# Altium schematic sheet 海关全向本体电路板V3_主控芯片.SchDoc
size A4
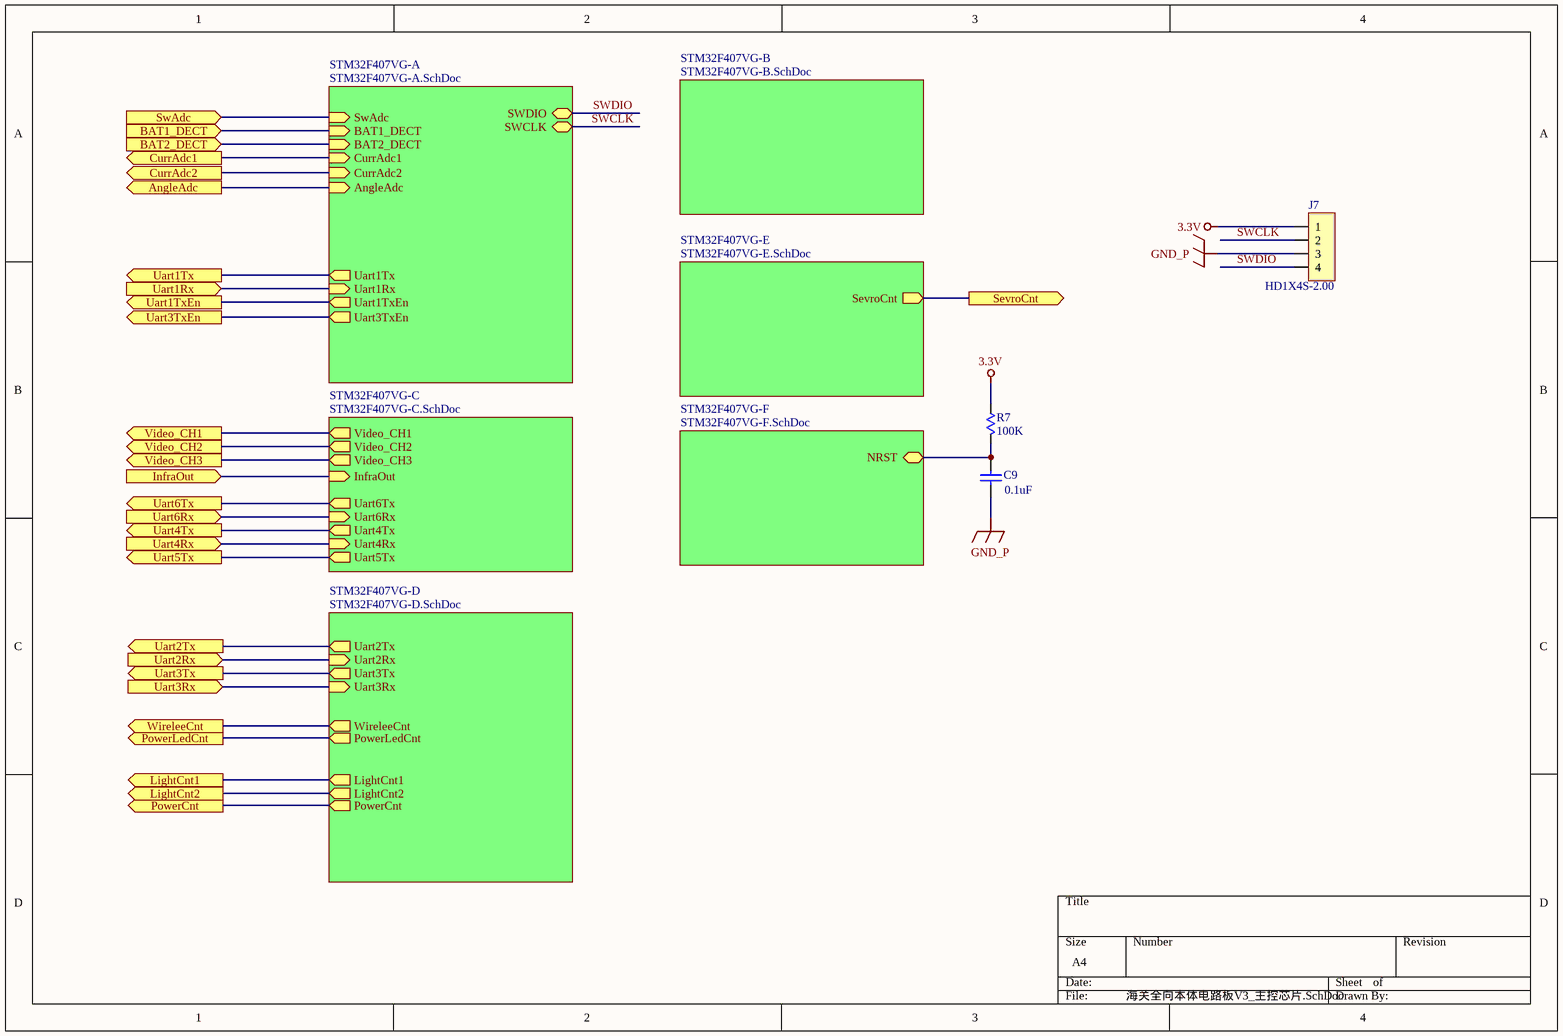
[diagram p0: 海关全向本体电路板V3_主控芯片.SchDoc]

## Parts
C9  0.1uF  [C0603-S]
J7  HD1X4S-2.00  [HD1X4S-2.00]
R7  100K  [R0603-S]

## Sub-sheets
STM32F407VG-A = STM32F407VG-A.SchDoc: SWDIO (bidir), SWCLK (bidir), Uart1Tx (out), Uart1Rx (in), AngleAdc (in), CurrAdc1 (in), BAT2_DECT (in), BAT1_DECT (in), SwAdc (in), CurrAdc2 (in), Uart1TxEn (out), Uart3TxEn (out)
STM32F407VG-B = STM32F407VG-B.SchDoc: no entries
STM32F407VG-C = STM32F407VG-C.SchDoc: Uart4Tx (out), Uart4Rx (in), Uart5Tx (out), Video_CH3 (out), Video_CH2 (out), Video_CH1 (out), Uart6Tx (out), Uart6Rx (in), InfraOut (in)
STM32F407VG-D = STM32F407VG-D.SchDoc: Uart2Tx (out), Uart2Rx (in), Uart3Tx (out), PowerLedCnt (out), LightCnt1 (out), Uart3Rx (in), PowerCnt (out), LightCnt2 (out), WireleeCnt (out)
STM32F407VG-E = STM32F407VG-E.SchDoc: SevroCnt (out)
STM32F407VG-F = STM32F407VG-F.SchDoc: NRST (bidir)

## Ports
AngleAdc (out), BAT1_DECT (in), BAT2_DECT (in), CurrAdc1 (out), CurrAdc2 (out), InfraOut (in), LightCnt1 (out), LightCnt2 (out), PowerCnt (out), PowerLedCnt (out), SevroCnt (out), SwAdc (in), Uart1Rx (in), Uart1Tx (out), Uart1TxEn (out), Uart2Rx (in), Uart2Tx (out), Uart3Rx (in), Uart3Tx (out), Uart3TxEn (out), Uart4Rx (in), Uart4Tx (out), Uart5Tx (out), Uart6Rx (in), Uart6Tx (out), Video_CH1 (out), Video_CH2 (out), Video_CH3 (out), WireleeCnt (out)

## Nets
3.3V: J7.1 R7.2
GND_P: C9.2 J7.3
AngleAdc: port AngleAdc, sheet STM32F407VG-A/AngleAdc
BAT1_DECT: port BAT1_DECT, sheet STM32F407VG-A/BAT1_DECT
BAT2_DECT: port BAT2_DECT, sheet STM32F407VG-A/BAT2_DECT
CurrAdc1: port CurrAdc1, sheet STM32F407VG-A/CurrAdc1
CurrAdc2: port CurrAdc2, sheet STM32F407VG-A/CurrAdc2
InfraOut: port InfraOut, sheet STM32F407VG-C/InfraOut
LightCnt1: port LightCnt1, sheet STM32F407VG-D/LightCnt1
LightCnt2: port LightCnt2, sheet STM32F407VG-D/LightCnt2
PowerCnt: port PowerCnt, sheet STM32F407VG-D/PowerCnt
PowerLedCnt: port PowerLedCnt, sheet STM32F407VG-D/PowerLedCnt
SevroCnt: port SevroCnt, sheet STM32F407VG-E/SevroCnt
SwAdc: port SwAdc, sheet STM32F407VG-A/SwAdc
SWCLK: J7.2 ; sheet STM32F407VG-A/SWCLK
SWDIO: J7.4 ; sheet STM32F407VG-A/SWDIO
Uart1Rx: port Uart1Rx, sheet STM32F407VG-A/Uart1Rx
Uart1Tx: port Uart1Tx, sheet STM32F407VG-A/Uart1Tx
Uart1TxEn: port Uart1TxEn, sheet STM32F407VG-A/Uart1TxEn
Uart2Rx: port Uart2Rx, sheet STM32F407VG-D/Uart2Rx
Uart2Tx: port Uart2Tx, sheet STM32F407VG-D/Uart2Tx
Uart3Rx: port Uart3Rx, sheet STM32F407VG-D/Uart3Rx
Uart3Tx: port Uart3Tx, sheet STM32F407VG-D/Uart3Tx
Uart3TxEn: port Uart3TxEn, sheet STM32F407VG-A/Uart3TxEn
Uart4Rx: port Uart4Rx, sheet STM32F407VG-C/Uart4Rx
Uart4Tx: port Uart4Tx, sheet STM32F407VG-C/Uart4Tx
Uart5Tx: port Uart5Tx, sheet STM32F407VG-C/Uart5Tx
Uart6Rx: port Uart6Rx, sheet STM32F407VG-C/Uart6Rx
Uart6Tx: port Uart6Tx, sheet STM32F407VG-C/Uart6Tx
Video_CH1: port Video_CH1, sheet STM32F407VG-C/Video_CH1
Video_CH2: port Video_CH2, sheet STM32F407VG-C/Video_CH2
Video_CH3: port Video_CH3, sheet STM32F407VG-C/Video_CH3
WireleeCnt: port WireleeCnt, sheet STM32F407VG-D/WireleeCnt
NetC9_1: C9.1 R7.1 ; sheet STM32F407VG-F/NRST

## Library data of the parts
C9 = Cap: Capacitor; Published: 8-Jun-2000; Revision: July-2002: Re-released for DXP Platform.; Publisher: Altium Limited; Value: 0.1uF
J7 = HEADER1X4
R7 = Res: Resistor; Published: 8-Jun-2000; LatestRevisionDate: 04-Mar-2005; LatestRevisionNote: PCB Footprint replaced.; PackageReference: J1-0603; Publisher: Altium Limited; Value: 100K